# Altium schematic sheet faulhaber.SchDoc
size A3
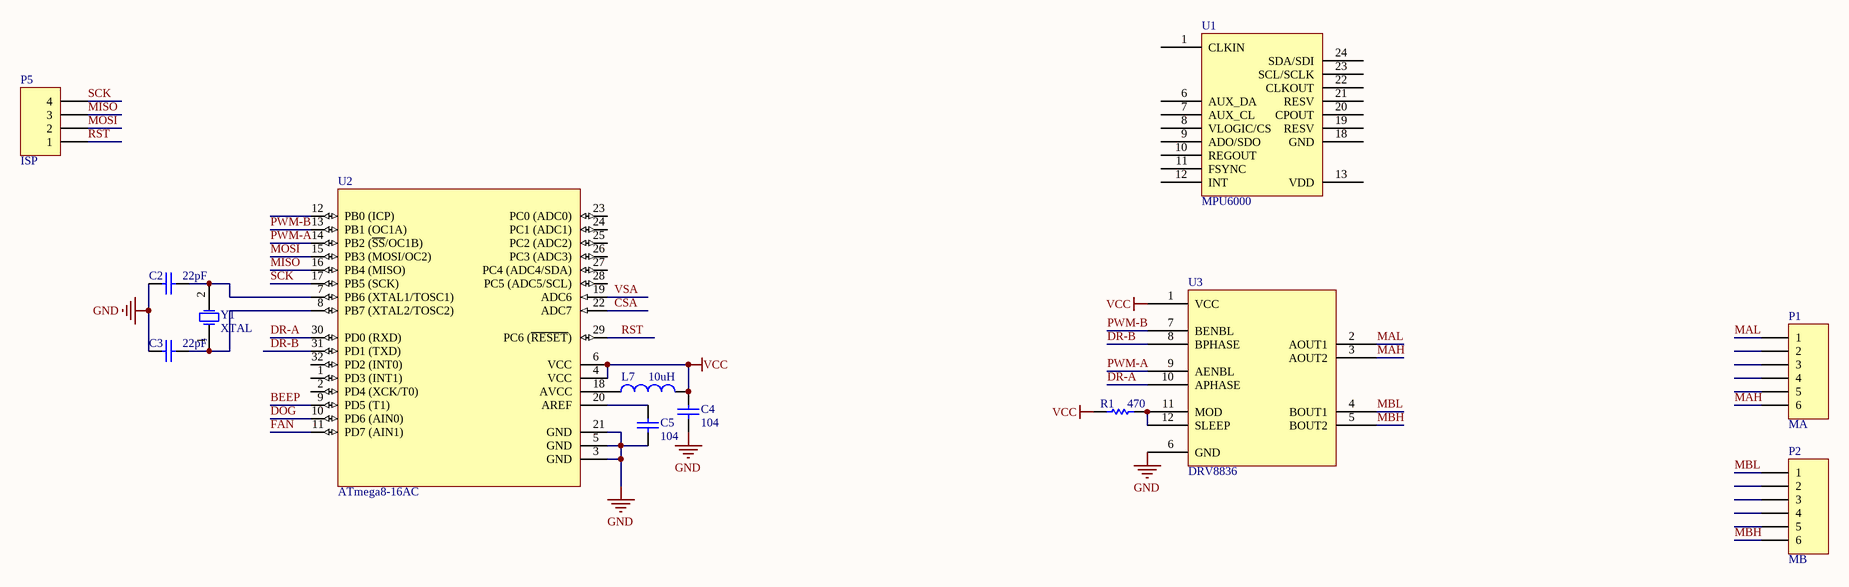
[diagram p0: faulhaber.SchDoc]

## Parts
C2  value 22pF  [0603]  (hidden comment: Cap)
C3  value 22pF  [0603]  (hidden comment: Cap)
C4  value 104  [0603]  (hidden comment: Cap)
C5  value 104  [0603]  (hidden comment: Cap)
L7  value 10uH  [0603]  (hidden comment: Inductor)
P1  MA  [HDR1X6]
P2  MB  [HDR1X6]
P5  ISP  [HDR1X4]
R1  value 470  [0603]  (hidden comment: Res1)
U1  MPU6000  [MPU-6000]
U2  ATmega8-16AC  [32A_M]
U3  DRV8836  [WSON-8]
Y1  XTAL  [49SD]

## Nets
GND: C2.2 C3.2 C4.2 C5.2 U2.3(GND) U2.5(GND) U2.21(GND) U3.6(GND)
VCC: C4.1 L7.2 R1.1 U2.4(VCC) U2.6(VCC) U3.1(VCC)
BEEP: U2.9(PD5_(T1))
CSA: U2.22(ADC7)
DOG: U2.10(PD6_(AIN0))
DR-A: U2.30(PD0_(RXD)) U3.10(APHASE)
DR-B: U2.31(PD1_(TXD)) U3.8(BPHASE)
FAN: U2.11(PD7_(AIN1))
MAH: P1.6 U3.3(AOUT2)
MAL: P1.1 U3.2(AOUT1)
MBH: P2.6 U3.5(BOUT2)
MBL: P2.1 U3.4(BOUT1)
MISO: P5.3 U2.16(PB4_(MISO))
MOSI: P5.2 U2.15(PB3_(MOSI/OC2))
PWM-A: U2.14(PB2_(~{SS}/OC1B)) U3.9(AENBL)
PWM-B: U2.13(PB1_(OC1A)) U3.7(BENBL)
RST: P5.1 U2.29(PC6_(~{RESET}))
SCK: P5.4 U2.17(PB5_(SCK))
VSA: U2.19(ADC6)
NetC2_1: C2.1 U2.7(PB6_(XTAL1/TOSC1)) Y1.2(OSC2)
NetC3_1: C3.1 U2.8(PB7_(XTAL2/TOSC2)) Y1.1(OSC1)
NetC5_1: C5.1 U2.20(AREF)
NetL7_1: L7.1 U2.18(AVCC)
NetR1_2: R1.2 U3.11(MOD) U3.12(SLEEP)

Not connected (* = marked no-connect by the designer): P1 2 3 4 5; P2 2 3 4 5; U1 1(CLKIN) 6(AUX_DA) 7(AUX_CL) 8(VLOGIC/CS) 9(ADO/SDO) 10(REGOUT) 11(FSYNC) 12(INT) 13(VDD) 18(GND) 19(RESV) 20(CPOUT) 21(RESV) 22(CLKOUT) 23(SCL/SCLK) 24(SDA/SDI); U2 1(PD3_(INT1)) 2(PD4_(XCK/T0)) 12(PB0_(ICP)) 23(PC0_(ADC0)) 24(PC1_(ADC1)) 25(PC2_(ADC2)) 26(PC3_(ADC3)) 27(PC4_(ADC4/SDA)) 28(PC5_(ADC5/SCL)) 32(PD2_(INT0))

## Library data of the parts
C2-C5 = Cap: Capacitor; Published: 8-Jun-2000; LatestRevisionDate: 17-Jul-2002; LatestRevisionNote: Re-released for DXP Platform.; PackageReference: RAD-0.3; Publisher: Altium Limited
L7 = Inductor: Code_IEC: 1005; Published: 8-Jun-2000; LatestRevisionDate: 17-Jul-2002; LatestRevisionNote: Re-released for DXP Platform.; PackageReference: 0402-A; Publisher: Altium Limited; Code_JEITA: 0402
P1 P2 = Header 6: Header, 6-Pin; LatestRevisionDate: 17-Jul-2002; LatestRevisionNote: Re-released for DXP Platform.; Publisher: Altium Limited
P5 = Header 4: Header, 4-Pin; LatestRevisionDate: 17-Jul-2002; LatestRevisionNote: Re-released for DXP Platform.; Publisher: Altium Limited
R1 = Res1: Resistor; Published: 8-Jun-2000; LatestRevisionDate: 17-Jul-2002; LatestRevisionNote: Re-released for DXP Platform.; PackageReference: AXIAL-0.3; Publisher: Altium Limited; PackageDescription: Axial Device, Thru-Hole; 2 Leads; 0.3 in Pin Spacing
U1 = MPU-6000
U2 = ATmega8-16AC: 8-Bit AVR Microcontroller with 8K Bytes of In-System Programmable Flash Memory; Published: 17-Sep-2003; LatestRevisionDate: 13-Apr-2006; LatestRevisionNote: IPC-7351 Footprint Added.; DatasheetVersion: 2486H-AVR-09/02; PackageVersion: revB, Oct-2001; PackageReference: 32A; Publisher: Altium Limited; PackageDescription: 32-Pin Thin Quad Flat Pack 0.8 mm Pitch; Code_JEDEC: MS-026-ABA; ComponentLink1Description: Manufacturer Link; ComponentLink1URL: http://www.atmel.com; ComponentLink2Description: Datasheet; ComponentLink2URL: http://www.atmel.com/dyn/resources/prod_documents/doc2486.pdf
Y1 = XTAL: Crystal Oscillator; Published: 8-Jun-2000; LatestRevisionDate: 17-Jul-2002; LatestRevisionNote: Re-released for DXP Platform.; PackageReference: R38; Publisher: Altium Limited